# Altium schematic sheet topSch.SchDoc
size A4; SheetNumber: 1; SheetTotal: 3
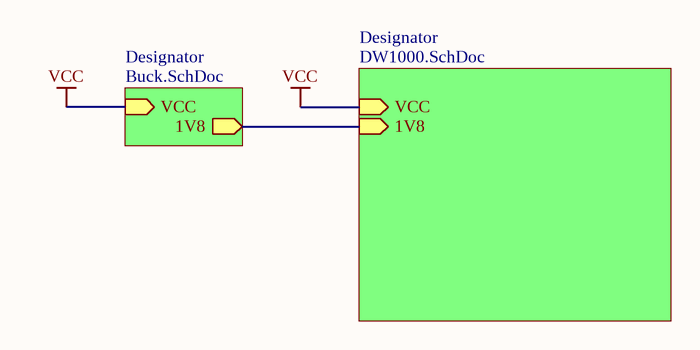
[diagram p0: topSch.SchDoc]

## Sub-sheets
Designator = DW1000.SchDoc: VCC (in), 1V8 (in)
Designator = Buck.SchDoc: VCC (in), 1V8 (out)

## Nets
VCC: sheet Designator/VCC, sheet Designator/VCC
(unnamed): sheet Designator/1V8, sheet Designator/1V8